# Altium schematic sheet DC_Control.SchDoc
size 148 x 105 mm
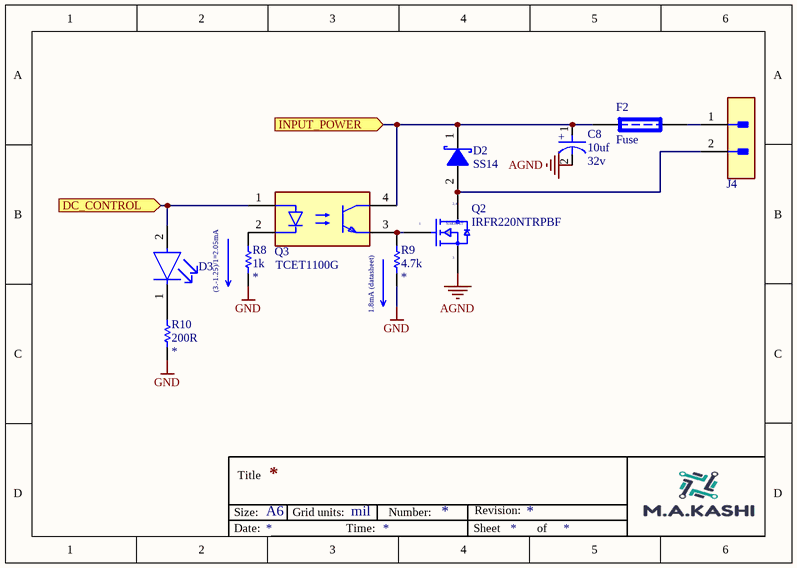
[diagram p0: DC_Control.SchDoc]

## Parts
C8  Capacitance: 10uf  Voltage: 32v  [CAP_electrolitic_5x5.4_Panasonic]  (hidden comment: Capacitor Electrolytic)
D2  SS14  [SS26FL_SS24FL_ONSemi_A]
D3  LED  [LED_0805_green_Dialight]  (value not drawn)
F2  Fuse  [FUSE]
J4  Connector  [Phoenix 2 0D]  (value not drawn)
Q2  IRFR220NTRPBF  [Infineon_PG-TO252-3_MFG]
Q3  TCET1100G  [DIP-4]
R8  1k  [RES_0805_A]
R9  4.7k  [RES_0805_A]
R10  200R  [RES_0805_A]

## Ports
DC_CONTROL (in), INPUT_POWER (in)

## Nets
AGND: C8.2(A) Q2.3(S)
GND: R8.2 R9.2 R10.2
DC_CONTROL: D3.2(A) Q3.1(A) ; port DC_CONTROL
INPUT_POWER: C8.1(C) D2.1(Cathode) F2.1 Q3.4(C) ; port INPUT_POWER
NetD2_2: D2.2(Anode) J4.2 Q2.4(D)
NetD3_1: D3.1(C) R10.1
NetF2_2: F2.2 J4.1
NetQ2_1: Q2.1(G) Q3.3(E) R9.1
NetQ3_2: Q3.2(C) R8.1

## Notes on the sheet
- (near R8) (3.-1.25)/1=2.05mA
- 1.8mA (datasheet)
- Size:
- Title
- A6
- Grid units:
- mil
- Number:
- Revision:
- Date:
- Time:
- Sheet
- of
- (in symbol Capacitor Electrolytic) +
- (in symbol IRFR220NTRPBF) 2,4; N-MOSFET

## Library data of the parts
D2 = Schottky Diode: Part Number: SS14
D3 = LED: Part Number: Add part number!
J4 = Connector 2 pin: Manufacturer: JST; helpURL: https://upverter.com/upn/revision/9474e29b2dfd49db/; ComponentLink2Description: Datasheet; Temperature: -25°C to +85°C; Package: HDR02; Supplier 2: Mouser; Supplier 1: Digi-Key; ComponentLink1URL: https://upverter.com/upn/revision/9474e29b2dfd49db/; Supplier Part Number 1: 455-2247-ND; ComponentLink1Description: Upverter; ComponentLink2URL: https://upverter.com/datasheet/c48c44605c8b0d25ef64da6eae03f392f2e627c8.pdf; RoHS: TRUE; Temperature Range High: +85°C; Digikey Description: CONN HEADER XH TOP 2POS 2.5MM; Digikey Part Number: 455-2247-ND; Temperature Range Low: -25°C; Lead Free: yes
Q2 = IRFR220NTRPBF: Part Number: DMP3099L-13
Q3 = Optocoupler-1ch: Part Number: TCET1100G
R8-R10 = Resistor: octopart or digikey description!; Part Number: *; Voltage Rating: *; Power Rating: *; Tolerance: *
  R8: Resistance: 1k
  R9: Resistance: 4.7k
  R10: Resistance: 200R
F2 = Fuse: Published: 8-Jun-2000; LatestRevisionDate: 17-Jul-2002; LatestRevisionNote: Re-released for DXP Platform.; PackageReference: PIN-W2/E2.8; Publisher: Altium Limited